# EAGLE design HITOMI (EAGLE 9.6.0)
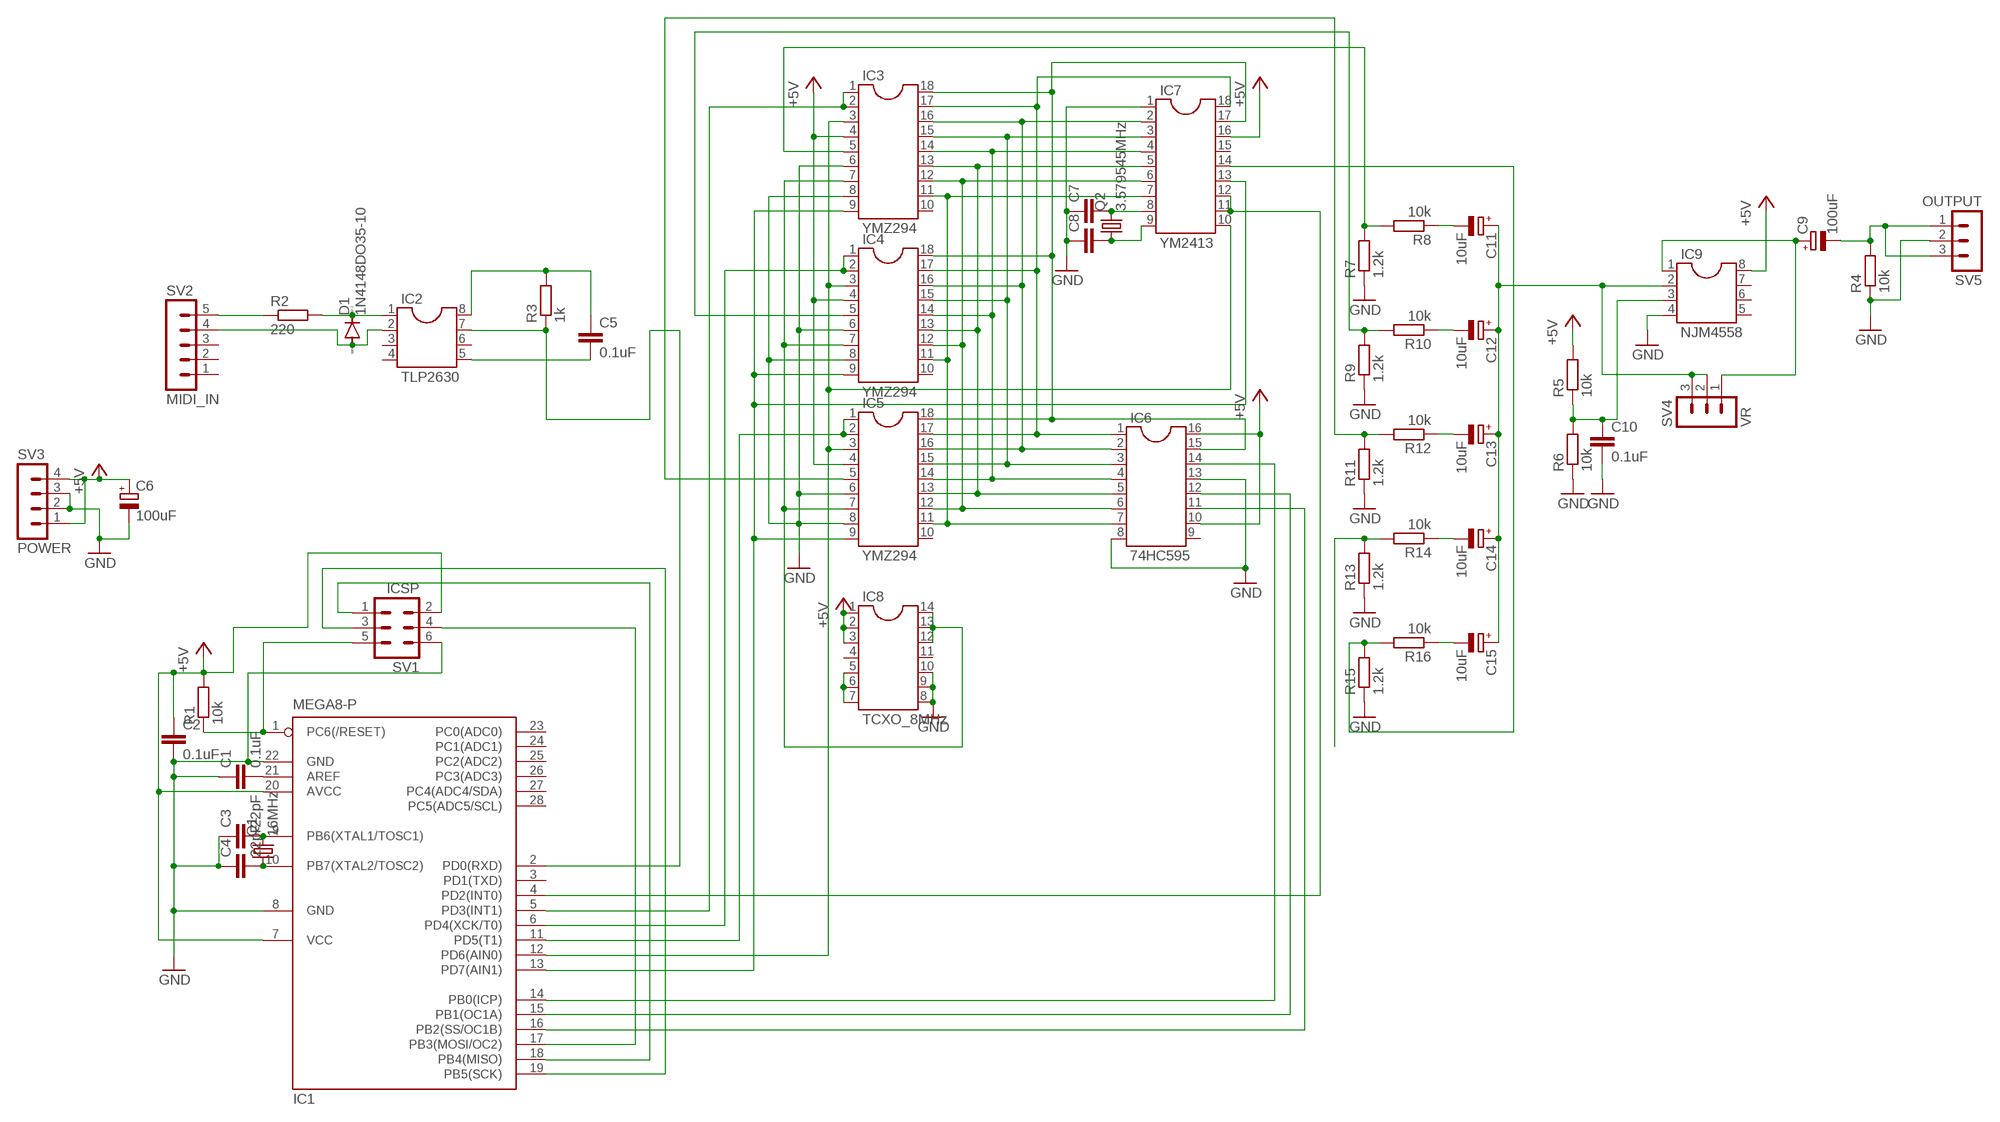
[diagram p0: schematic, sheet 1]

## Parts
C1  0.1uF  C-EU050-025X075  [C050-025X075]
C2  0.1uF  C-EU050-025X075  [C050-025X075]
C3  22pF  C-EU050-025X075  [C050-025X075]
C4  22pF  C-EU050-025X075  [C050-025X075]
C5  0.1uF  C-EU050-025X075  [C050-025X075]
C6  100uF  CPOL-EUE2.5-7  [E2,5-7]
C7  C-EU050-025X075  [C050-025X075]
C8  C-EU050-025X075  [C050-025X075]
C9  100uF  CPOL-EUE2.5-7  [E2,5-7]
C10  0.1uF  C-EU050-025X075  [C050-025X075]
C11  10uF  CPOL-EUE2.5-7  [E2,5-7]
C12  10uF  CPOL-EUE2.5-7  [E2,5-7]
C13  10uF  CPOL-EUE2.5-7  [E2,5-7]
C14  10uF  CPOL-EUE2.5-7  [E2,5-7]
C15  10uF  CPOL-EUE2.5-7  [E2,5-7]
D1  1N4148DO35-10  [DO35-10]
IC1  MEGA8-P  [DIL28-3]
IC2  TLP2630  DIL8  [DIL08]
IC3  YMZ294  DIL18S  [SOCKET-18]
IC4  YMZ294  DIL18S  [SOCKET-18]
IC5  YMZ294  DIL18S  [SOCKET-18]
IC6  74HC595  DIL16S  [SOCKET-16]
IC7  YM2413  DIL18S  [SOCKET-18]
IC8  TCXO_8MHz  DIL14  [DIL14]
IC9  NJM4558  DIL8  [DIL08]
Q1  16MHz  CRYSTALHC49S  [HC49/S]
Q2  3.579545MHz  CRYSTALHC49S  [HC49/S]
R1  10k  R-EU_0207/10  [0207/10]
R2  220  R-EU_0207/10  [0207/10]
R3  1k  R-EU_0207/10  [0207/10]
R4  10k  R-EU_0207/10  [0207/10]
R5  10k  R-EU_0207/10  [0207/10]
R6  10k  R-EU_0207/10  [0207/10]
R7  1.2k  R-EU_0207/10  [0207/10]
R8  10k  R-EU_0207/10  [0207/10]
R9  1.2k  R-EU_0207/10  [0207/10]
R10  10k  R-EU_0207/10  [0207/10]
R11  1.2k  R-EU_0207/10  [0207/10]
R12  10k  R-EU_0207/10  [0207/10]
R13  1.2k  R-EU_0207/10  [0207/10]
R14  10k  R-EU_0207/10  [0207/10]
R15  1.2k  R-EU_0207/10  [0207/10]
R16  10k  R-EU_0207/10  [0207/10]
SV1  ICSP  MA03-2  [MA03-2]
SV2  MIDI_IN  MA05-1  [MA05-1]
SV3  POWER  MA04-1  [MA04-1]
SV4  VR  MA03-1  [MA03-1]
SV5  OUTPUT  MA03-1  [MA03-1]

## Nets
+5V: C2.1 C6.+ IC1.7(VCC) IC1.20(AVCC) IC3.4 IC4.4 IC5.4 IC6.10 IC6.16 IC7.16 IC8.1 IC8.2 IC8.3 IC9.8 R1.2 R5.2 SV1.2 SV3.1 SV3.4
GND: C1.1 C2.2 C3.1 C4.1 C6.- C7.1 C8.1 C10.2 IC1.8(GND) IC1.22(GND) IC3.6 IC3.8 IC4.6 IC4.8 IC5.6 IC5.8 IC6.8 IC6.13 IC7.1 IC8.8 IC8.9 IC8.10 IC9.4 R4.1 R6.1 R7.1 R9.1 R11.1 R13.1 R15.1 SV1.6 SV3.2 SV3.3 SV5.2
N$1: IC1.1(PC6(/RESET)) R1.1 SV1.5
N$2: IC1.17(PB3(MOSI/OC2)) SV1.4
N$3: IC1.18(PB4(MISO)) SV1.1
N$4: C1.2 IC1.21(AREF)
N$5: C3.2 IC1.9(PB6(XTAL1/TOSC1)) Q1.2
N$6: C4.2 IC1.10(PB7(XTAL2/TOSC2)) Q1.1
N$7: IC1.19(PB5(SCK)) SV1.3
N$8: IC3.18 IC4.18 IC5.18 IC6.15 IC7.17
N$9: D1.A IC2.2 SV2.4
N$10: R2.1 SV2.5
N$11: D1.C IC2.1 R2.2
N$12: C5.1 IC2.8 R3.2
N$13: C5.2 IC2.5
N$15: IC1.5(PD3(INT1)) IC3.1 IC3.2
N$16: IC3.11 IC4.11 IC5.11 IC6.7 IC7.7
N$17: IC3.12 IC4.12 IC5.12 IC6.6 IC7.6
N$18: IC3.13 IC4.13 IC5.13 IC6.5 IC7.5
N$19: IC3.14 IC4.14 IC5.14 IC6.4 IC7.4
N$20: IC3.15 IC4.15 IC5.15 IC6.3 IC7.3
N$21: IC3.16 IC4.16 IC5.16 IC6.2 IC7.2
N$22: IC3.17 IC4.17 IC5.17 IC6.1 IC7.18
N$23: IC1.6(PD4(XCK/T0)) IC4.1 IC4.2
N$24: IC1.11(PD5(T1)) IC5.1 IC5.2
N$25: IC1.12(PD6(AIN0)) IC3.3 IC4.3 IC5.3 IC7.10
N$26: C11.+ C12.+ C13.+ C14.+ C15.+ IC9.2 SV4.2 SV4.3
N$27: IC1.4(PD2(INT0)) IC7.11 IC7.12
N$28: IC3.7 IC4.7 IC5.7 IC8.12 IC8.13 IC8.14
N$29: IC8.5 IC8.6 IC8.7
N$30: IC1.13(PD7(AIN1)) IC3.9 IC4.9 IC5.9 IC7.13
N$31: C9.+ IC9.1 SV4.1
N$32: C7.2 IC7.8 Q2.2
N$33: C8.2 IC7.9 Q2.1
N$34: IC1.14(PB0(ICP)) IC6.14
N$35: IC1.15(PB1(OC1A)) IC6.12
N$36: IC1.16(PB2(SS/OC1B)) IC6.11
N$37: C10.1 IC9.3 R5.1 R6.2
N$38: C9.- R4.2 SV5.1 SV5.3
N$39: IC3.5 R7.2 R8.2
N$40: C11.- R8.1
N$41: IC4.5 R9.2 R10.2
N$42: C12.- R10.1
N$43: IC5.5 R11.2 R12.2
N$44: C13.- R12.1
N$45: R13.2 R14.2
N$46: C14.- R14.1
N$47: IC7.14 R15.2 R16.2
N$48: C15.- R16.1
N$49: IC1.2(PD0(RXD)) IC2.7 R3.1
Unconnected: IC1.3(PD1(TXD)) IC1.23(PC0(ADC0)) IC1.24(PC1(ADC1)) IC1.25(PC2(ADC2)) IC1.26(PC3(ADC3)) IC1.27(PC4(ADC4/SDA)) IC1.28(PC5(ADC5/SCL)) IC2.3 IC2.4 IC2.6 IC3.10 IC4.10 IC5.10 IC6.9 IC7.15 IC8.4 IC8.11 IC9.5 IC9.6 IC9.7 SV2.1 SV2.2 SV2.3

## Library data of the parts
C1-C5 C7 C8 C10 = rcl:C-EU: CAPACITOR, European symbol; SPICEPREFIX: C
C6 C9 C11-C15 = rcl:CPOL-EU: POLARIZED CAPACITOR, European symbol; SPICEPREFIX: C
D1 = diode:1N4148: DIODE high speed (Philips)
IC1 = atmel:MEGA8-P: MICROCONTROLLER 8 Kbytes FLASH, 1 kbytes SRAM, 512 bytes EEPROM, USART, 4-channel 10 bit ADC, 2-channel 8 bit ADC Pin compatible with Atmega48, ATMega88, ATMega168 Source: avr.lbr; OC_FARNELL: unknown; OC_NEWARK: unknown
IC2 IC9 = ic-package:DIL8: Dual In Line / Socket
IC3-IC5 IC7 = ic-package:DIL18: Dual In Line / Socket
IC6 = ic-package:DIL16: Dual In Line / Socket
IC8 = ic-package:DIL14: Dual In Line / Socket
Q1 Q2 = crystal:CRYSTAL: CRYSTAL; OC_FARNELL: 1667008; OC_NEWARK: unknown
R1-R16 = rcl:R-EU_: RESISTOR, European symbol; SPICEPREFIX: R
SV1 = con-lstb:MA03-2: PIN HEADER; OC_FARNELL: unknown; OC_NEWARK: unknown
SV2 = con-lstb:MA05-1: PIN HEADER; OC_FARNELL: unknown; OC_NEWARK: unknown
SV3 = con-lstb:MA04-1: PIN HEADER; OC_FARNELL: unknown; OC_NEWARK: unknown
SV4 SV5 = con-lstb:MA03-1: PIN HEADER; OC_FARNELL: unknown; OC_NEWARK: unknown

## Net classes
0 default: width 0.889 mm

## Board
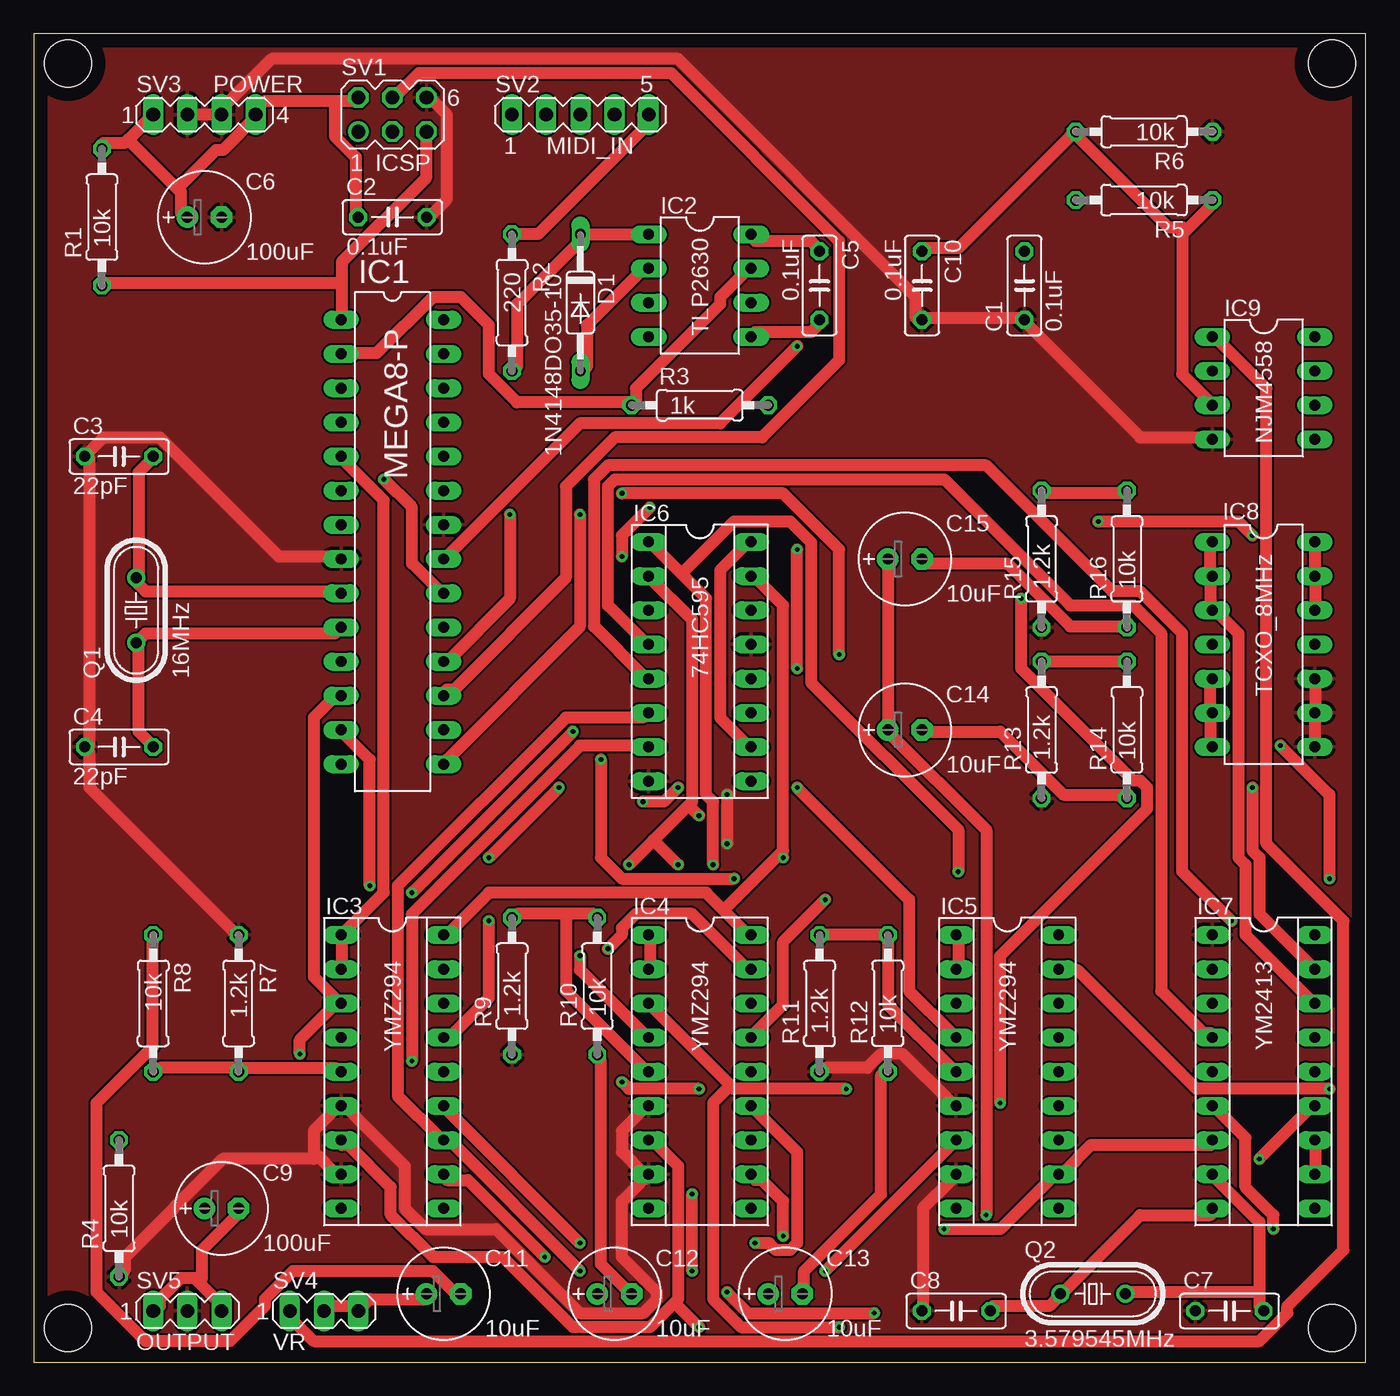
[diagram p1: board, top side]
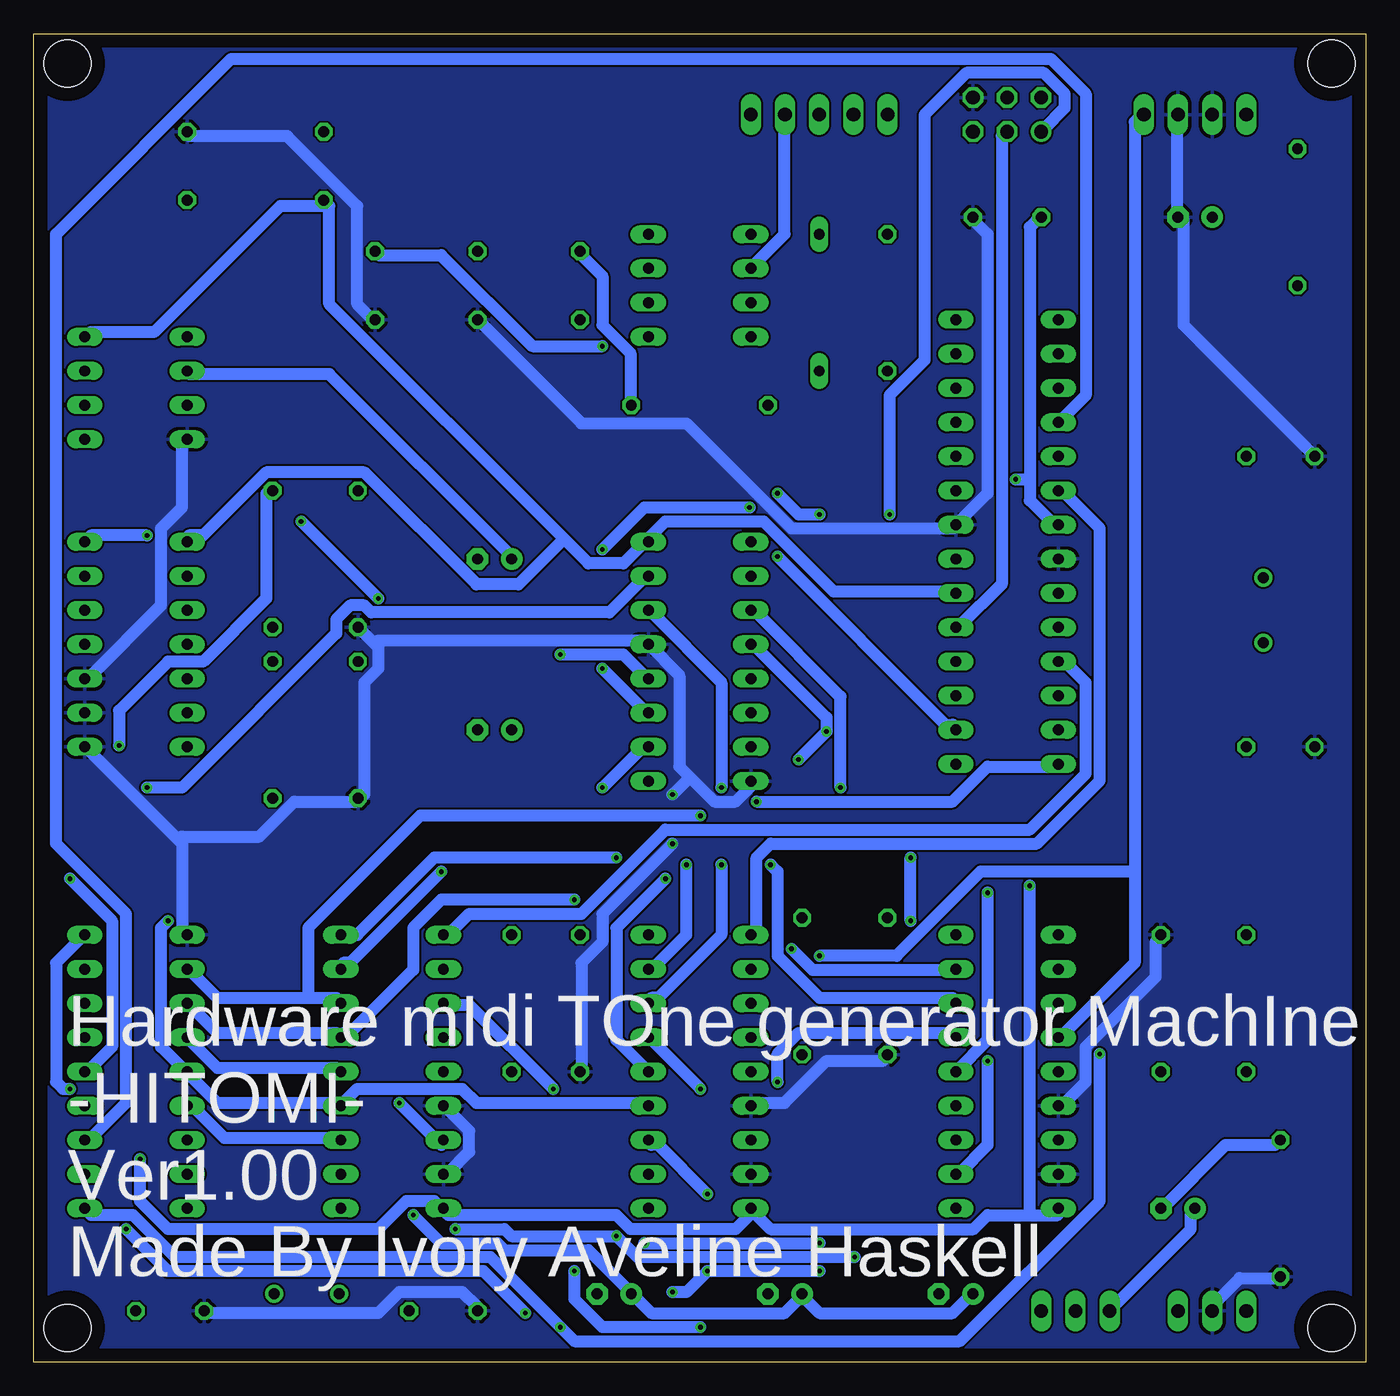
[diagram p2: board, bottom side, seen from below]

Size 99.04 x 98.73 mm. Coordinates in mm from the lower left corner, seen from the top.
Outline: 0,0 99.04,0 99.04,98.73 0,98.73 0,0
Copper layers (1*16): Top 0.035mm / dielectric 1.5mm / Bottom 0.035mm
Design rules "default": minimum track width 6mil, minimum drill 0.35mm, track to track 6mil, track to pad 6mil, pad to pad 6mil, via to via 6mil, smd to smd 6mil, copper to edge 40mil, drill to drill 6mil, minimum pad ring 10mil, minimum via ring 8mil, stop-mask expansion 4mil, vias tented up to drill 0mil, thermal gap 10mil
Holes 3.5 mm at 2.54,96.52 2.54,2.54 96.52,2.54 96.52,96.52

### Footprints (pad centres in the part's own frame; a part is rotated, then mirrored left to right if it is on the bottom)
C050-025X075 = drill 0.813 octagon: 1 -2.54,0; 2 2.54,0
E2,5-7 = drill 0.813 pad 1.6: + -1.27,0 | drill 0.813 pad 1.6 octagon: - 1.27,0
DO35-10 = drill 0.813 long: A 5.08,0; C -5.08,0
DIL28-3 = drill 0.813 long: 1 -16.51,-3.81; 2 -13.97,-3.81; 3 -11.43,-3.81; 4 -8.89,-3.81; 5 -6.35,-3.81; 6 -3.81,-3.81; 7 -1.27,-3.81; 8 1.27,-3.81; 9 3.81,-3.81; 10 6.35,-3.81; 11 8.89,-3.81; 12 11.43,-3.81; 13 13.97,-3.81; 14 16.51,-3.81; 15 16.51,3.81; 16 13.97,3.81; 17 11.43,3.81; 18 8.89,3.81; 19 6.35,3.81; 20 3.81,3.81; 21 1.27,3.81; 22 -1.27,3.81; 23 -3.81,3.81; 24 -6.35,3.81; 25 -8.89,3.81; 26 -11.43,3.81; 27 -13.97,3.81; 28 -16.51,3.81
DIL08 = drill 0.813 long: 1 -3.81,-3.81; 2 -1.27,-3.81; 3 1.27,-3.81; 4 3.81,-3.81; 5 3.81,3.81; 6 1.27,3.81; 7 -1.27,3.81; 8 -3.81,3.81
SOCKET-18 = drill 0.813 long: 1 -10.16,-3.81; 2 -7.62,-3.81; 3 -5.08,-3.81; 4 -2.54,-3.81; 5 0,-3.81; 6 2.54,-3.81; 7 5.08,-3.81; 8 7.62,-3.81; 9 10.16,-3.81; 10 10.16,3.81; 11 7.62,3.81; 12 5.08,3.81; 13 2.54,3.81; 14 0,3.81; 15 -2.54,3.81; 16 -5.08,3.81; 17 -7.62,3.81; 18 -10.16,3.81
SOCKET-16 = drill 0.813 long: 1 -8.89,-3.81; 2 -6.35,-3.81; 3 -3.81,-3.81; 4 -1.27,-3.81; 5 1.27,-3.81; 6 3.81,-3.81; 7 6.35,-3.81; 8 8.89,-3.81; 9 8.89,3.81; 10 6.35,3.81; 11 3.81,3.81; 12 1.27,3.81; 13 -1.27,3.81; 14 -3.81,3.81; 15 -6.35,3.81; 16 -8.89,3.81
DIL14 = drill 0.813 long: 1 -7.62,-3.81; 2 -5.08,-3.81; 3 -2.54,-3.81; 4 0,-3.81; 5 2.54,-3.81; 6 5.08,-3.81; 7 7.62,-3.81; 8 7.62,3.81; 9 5.08,3.81; 10 2.54,3.81; 11 0,3.81; 12 -2.54,3.81; 13 -5.08,3.81; 14 -7.62,3.81
HC49/S = drill 0.813: 1 -2.413,0; 2 2.413,0
0207/10 = drill 0.813 octagon: 1 -5.08,0; 2 5.08,0
MA03-2 = drill 1.016: 1 -2.54,-1.27 | drill 1.016 octagon: 2 -2.54,1.27; 3 0,-1.27; 4 0,1.27; 5 2.54,-1.27; 6 2.54,1.27
MA05-1 = drill 1.016 long: 1 -5.08,0; 2 -2.54,0; 3 0,0; 4 2.54,0; 5 5.08,0
MA04-1 = drill 1.016 long: 1 -3.81,0; 2 -1.27,0; 3 1.27,0; 4 3.81,0
MA03-1 = drill 1.016 long: 1 -2.54,0; 2 0,0; 3 2.54,0

### Placement (x,y rotation side)
C1  73.66,80.01 90 top
C2  26.67,85.09 0 top
C3  6.35,67.31 0 top
C4  6.35,45.72 0 top
C5  58.42,80.01 270 top
C6  12.7,85.09 0 top
C7  88.9,3.81 0 top
C8  68.58,3.81 0 top
C9  13.97,11.43 0 top
C10  66.04,80.01 270 top
C11  30.48,5.08 0 top
C12  43.18,5.08 0 top
C13  55.88,5.08 0 top
C14  64.77,46.99 0 top
C15  64.77,59.69 0 top
D1  40.64,78.74 270 top
IC1  26.67,60.96 270 top
IC2  49.53,80.01 270 top
IC3  26.67,21.59 270 top
IC4  49.53,21.59 270 top
IC5  72.39,21.59 270 top
IC6  49.53,52.07 270 top
IC7  91.44,21.59 270 top
IC8  91.44,53.34 270 top
IC9  91.44,72.39 270 top
Q1  7.62,55.88 90 top
Q2  78.74,5.08 0 top
R1  5.08,85.09 90 top
R2  35.56,78.74 270 top
R3  49.53,71.12 0 top
R4  6.35,11.43 90 top
R5  82.55,86.36 180 top
R6  82.55,91.44 180 top
R7  15.24,26.67 270 top
R8  8.89,26.67 270 top
R9  35.56,27.94 90 top
R10  41.91,27.94 90 top
R11  58.42,26.67 90 top
R12  63.5,26.67 90 top
R13  74.93,46.99 90 top
R14  81.28,46.99 90 top
R15  74.93,59.69 90 top
R16  81.28,59.69 90 top
SV1  26.67,92.71 0 top
SV2  40.64,92.71 0 top
SV3  12.7,92.71 0 top
SV4  21.59,3.81 0 top
SV5  11.43,3.81 0 top

### Tracks (layer width: path | path; a pad name or v marks a point on that pad's centre or on a via)
+5V  (via drill 0.35)
  Top 0.889: 7.03,90.86 8.85,92.69 SV3.1 | 7.03,90.86 6.77,90.6 5.21,90.6 R1.2 | 7.03,90.86 10.67,87.22 | 10.67,87.22 10.94,86.96 10.94,85.39 C6.+ | v40.62,30.2 40.62,29.16 45.3,24.47 IC4.4 | 22.39,93.73 17.18,93.73 16.66,93.2 SV3.4 16.66,92.69 14.06,90.08 13.54,90.08 10.67,87.22 | 22.39,93.73 23.95,93.73 SV1.2 | 22.39,93.73 22.39,91.12 23.95,89.56 23.95,85.39 C2.1 | IC7.16 94.77,27.08 90.08,31.76 90.08,36.97 89.56,37.49 89.56,54.15 88,55.72 IC8.3 87.48,56.24 87.48,58.32 IC8.2 87.48,58.84 87.48,60.92 IC8.1 | IC6.10 53.11,45.82 51.03,47.9 51.03,58.84 53.11,60.92 IC6.16 | v56.76,42.7 65.09,34.37 65.09,27.6 68.21,24.47 IC5.4 | v26.04,65.61 28.12,63.52 28.12,59.36 30.2,57.28 IC1.20
  Bottom 0.889: 24.99,65.61 24.99,84.35 24.47,84.87 C2.1 | 24.99,65.61 24.99,64.05 23.43,62.48 22.91,62.48 IC1.7 | 17.18,36.45 17.18,92.16 16.66,92.69 SV3.4 | 17.18,36.45 17.18,29.68 22.39,24.47 IC3.4 | v40.62,30.2 34.89,30.2 28.64,36.45 17.18,36.45 | IC9.8 94.77,76.54 90.08,76.54 80.71,85.92 77.58,85.92 R5.2 77.06,85.92 77.06,78.63 59.62,61.18 | v56.76,42.7 53.63,45.82 IC6.10 | IC1.20 30.72,57.28 39.57,57.28 44.78,62.48 52.07,62.48 53.11,61.44 IC6.16 53.63,60.92 55.19,59.36 57.8,59.36 59.62,61.18 | 59.62,61.18 63.01,57.8 66.13,57.8 74.46,66.13 81.75,66.13 86.44,61.44 87.48,61.44 IC8.1 | v26.04,65.61 24.99,65.61
GND  (via drill 0.35)
  Top 0.889: SV3.2 11.46,92.69 13.54,92.69 SV3.3 14.06,93.2 17.7,96.85 47.9,96.85 65.61,79.15 65.61,77.58 C10.2 66.13,77.58 73.42,77.58 C1.1 73.94,77.06 82.27,68.73 87.48,68.73 IC9.4 | IC1.8 22.39,59.88 18.22,59.88 9.37,68.73 5.21,68.73 4.17,67.69 C3.1 4.17,67.17 4.17,45.82 C4.1 4.17,45.3 4.17,42.7 15.1,31.76 R7.1 | IC4.6 45.3,18.75 43.74,17.18 43.74,15.62 45.3,14.06 IC4.8 45.3,13.54 43.74,11.98 43.74,7.81 46.34,5.21 46.34,4.69 45.3,3.65 40.62,3.65 34.37,9.89 29.16,9.89 27.6,11.46 27.6,14.58 22.91,19.27 IC3.6 22.39,18.75 20.83,17.18 20.83,15.62 21.09,15.36 | 21.09,15.36 22.39,14.06 IC3.8 | R4.1 6.77,6.77 6.77,7.81 14.06,15.1 20.83,15.1 21.09,15.36 | SV1.6 29.68,93.73 30.72,92.69 30.72,86.44 29.68,85.39 C2.2 | C8.1 66.13,4.17 66.13,11.46 68.21,13.54 IC5.8 | R11.1 58.84,21.87 61.96,21.87 63.01,22.91 64.57,22.91 68.21,19.27 IC5.6 | IC8.10 95.29,50.51 95.29,48.42 IC8.9 95.29,47.9 95.29,45.82 IC8.8 | v51.55,42.18 v51.55,38.53
  Bottom 0.889: SV3.3 14.06,92.69 14.06,85.39 C6.- 13.54,84.87 13.54,77.06 4.17,67.69 C3.1 | R9.1 35.93,22.39 40.09,22.39 43.22,19.27 45.3,19.27 IC4.6 | R4.1 6.77,6.25 9.37,6.25 11.46,4.17 SV5.2 | R7.1 15.62,31.24 15.62,28.64 20.83,23.43 20.83,20.83 22.39,19.27 IC3.6 | C2.2 29.16,84.87 28.12,83.83 28.12,64.57 30.2,62.48 IC1.22 30.72,61.96 42.7,61.96 50.51,69.77 58.32,69.77 65.61,77.06 C10.2 | R6.1 87.48,91.12 80.19,91.12 74.98,85.92 74.98,78.63 73.94,77.58 C1.1 | IC5.6 68.21,18.75 66.65,17.18 66.65,15.62 68.21,14.06 IC5.8 | C7.1 85.92,3.65 73.42,3.65 71.86,5.21 67.17,5.21 66.13,4.17 C8.1 | 50.25,43.48 51.03,44.26 51.03,51.03 IC6.13 53.63,53.63 73.42,53.63 73.68,53.37 | 50.25,43.48 48.42,41.66 46.86,41.66 45.82,42.7 IC6.8 | 73.68,53.37 74.46,54.15 R15.1 | 73.68,53.37 73.42,53.11 73.42,51.55 74.46,50.51 74.46,42.18 R13.1 74.98,41.66 79.67,41.66 82.27,39.05 88,39.05 88.26,38.79 | 88.26,38.79 94.77,45.3 IC8.8 | 88.26,38.79 88,38.53 88,31.76 IC7.1 | v51.55,38.53 56.76,33.33 56.76,31.24 58.32,29.68 58.32,21.87 R11.1 | 50.25,43.48 v51.55,42.18 | IC9.4 88,68.21 88,63.52 89.56,61.96 89.56,56.24 94.77,51.03 IC8.10
  pour Bottom: 0,99.06 0,0 99.06,0 99.06,99.06
  pour Top: 0,99.06 0,0 99.06,0 99.06,99.06
N$1
  Top 0.889: 22.91,80.19 22.91,81.75 29.16,88 29.16,91.12 SV1.5 | 22.91,80.19 22.91,77.58 IC1.1 | 22.91,80.19 5.21,80.19 R1.1
N$2
  Top 0.889: IC1.17 30.72,49.99 31.24,49.99 39.57,58.32 39.57,65.09 43.22,68.73 54.15,68.73 59.88,74.46 59.88,83.31 47.38,95.81 28.64,95.81 27.08,94.25 SV1.4
N$3  (via drill 0.35)
  Top 0.889: v35.41,63.01 35.41,56.76 30.72,52.07 IC1.18
  Bottom 0.889: v35.41,63.01 35.41,71.86 32.8,74.46 32.8,92.69 29.68,95.81 23.95,95.81 22.39,94.25 22.39,93.2 23.95,91.64 SV1.1
N$4  (via drill 0.35)
  Top 0.889: v56.76,75.5 51.03,69.77 40.62,69.77 30.72,59.88 IC1.21
  Bottom 0.889: v56.76,75.5 61.96,75.5 68.73,82.27 73.42,82.27 C1.2
N$5
  Top 0.889: C3.2 8.85,67.17 7.81,66.13 7.81,58.32 Q1.2 7.81,57.8 8.33,57.28 22.39,57.28 IC1.9
N$6
  Top 0.889: C4.2 8.85,45.82 7.81,46.86 7.81,53.11 Q1.1 7.81,53.63 8.33,54.15 22.39,54.15 IC1.10
N$7
  Bottom 0.889: IC1.19 30.2,54.67 27.08,57.8 27.08,91.12 SV1.3
N$8  (via drill 0.35)
  Top 0.889: 51.29,33.59 53.11,31.76 IC4.18 | 51.29,33.59 49.99,34.89 33.85,34.89 30.72,31.76 IC3.18 | 51.29,33.59 55.45,37.75 | 55.45,37.75 55.72,38.01 55.72,56.24 53.63,58.32 IC6.15 | v55.72,37.49 55.45,37.75 | v90.6,42.7 90.6,38.01 91.12,37.49 91.12,33.33 94.77,29.68 IC7.17
  Bottom 0.889: v55.72,37.49 69.25,37.49 74.98,31.76 76.02,31.76 IC5.18 | v90.6,42.7 88,42.7 76.54,54.15 76.54,55.19 75.5,56.24 74.46,56.24 73.94,55.72 56.24,55.72 53.63,58.32 IC6.15
N$9
  Top 0.889: D1.A 41.13,73.94 41.13,77.06 45.3,81.23 IC2.2
  Bottom 0.889: SV2.4 43.22,92.69 43.22,83.83 45.3,81.75 IC2.2
N$10
  Top 0.889: R2.1 35.93,83.83 37.49,83.83 45.3,91.64 45.3,92.69 SV2.5
N$11
  Top 0.889: R2.2 35.93,73.94 35.93,78.63 40.62,83.31 D1.C 41.13,83.83 45.3,83.83 IC2.1
N$12
  Top 0.889: IC2.8 53.63,83.31 57.8,83.31 58.32,82.79 C5.1
  Bottom 0.889: R3.2 54.67,71.34 54.67,74.98 56.76,77.06 56.76,80.71 58.32,82.27 C5.1
N$13
  Top 0.889: IC2.5 53.63,76.54 57.8,76.54 58.32,77.06 C5.2
N$15
  Top 0.889: IC3.2 22.91,29.68 22.91,31.24 IC3.1 22.91,31.76 26.04,34.89 26.04,64.05 22.91,67.17 IC1.5
N$16  (via drill 0.35)
  Top 0.889: v55.72,9.37 55.72,11.98 54.15,13.54 53.63,13.54 IC4.11 | v67.69,9.89 71.86,9.89 76.02,14.06 IC5.11 76.54,14.06 78.63,16.14 87.48,16.14 IC7.7 | v28.12,22.39 28.12,33.33 40.62,45.82 45.3,45.82 IC6.7 | v38.01,7.81 32.28,13.54 30.72,13.54 IC3.11
  Bottom 0.889: v67.69,9.89 64.05,9.89 63.52,9.37 v55.72,9.37 54.15,7.81 v38.01,7.81 | v28.12,22.39 28.12,16.14 30.2,14.06 IC3.11
N$17  (via drill 0.35)
  Top 0.889: IC6.6 45.3,47.9 39.57,47.9 27.08,35.41 27.08,19.79 30.2,16.66 IC3.12 30.72,16.66 v40.62,6.77 | v48.95,6.77 v48.95,12.5 | v92.16,9.89 92.16,10.94 90.08,13.02 90.08,16.66 88,18.75 IC7.6 | v62.48,3.65 53.11,3.65 v51.55,5.21
  Bottom 0.889: IC5.12 76.54,16.66 84.87,16.66 87.48,19.27 IC7.6 | v48.95,12.5 52.59,16.14 53.11,16.14 IC4.12 | v40.62,6.77 v48.95,6.77 50.51,5.21 v51.55,5.21 | v92.16,9.89 89.04,6.77 65.61,6.77 v62.48,3.65
N$18  (via drill 0.35)
  Top 0.889: v40.62,8.85 30.72,18.75 IC3.13 | v53.63,8.85 54.67,8.85 55.19,8.33 56.24,8.33 56.76,8.85 56.76,15.62 53.63,18.75 IC4.13 | v89.04,32.8 85.39,36.45 85.39,54.15 82.27,57.28 80.19,57.28 70.81,66.65 42.7,66.65 41.66,65.61 41.66,54.67 45.3,51.03 IC6.5
  Bottom 0.889: v53.63,8.85 v40.62,8.85 | v89.04,32.8 89.56,32.28 89.56,23.43 88,21.87 IC7.5 87.48,21.35 85.39,19.27 76.54,19.27 IC5.13 76.02,19.27 74.98,20.31 67.17,20.31 66.13,19.27 53.63,19.27 IC4.13
N$19  (via drill 0.35)
  Top 0.889: v40.09,46.86 v28.12,34.89 | v52.07,35.93 43.74,35.93 42.18,37.49 v42.18,44.78 | IC7.4 87.48,24.47 86.96,24.47 83.83,27.6 83.83,54.15 81.75,56.24 77.06,56.24 67.69,65.61 43.22,65.61 42.7,65.09 42.7,56.24 45.3,53.63 IC6.4
  Bottom 0.889: IC5.14 76.54,21.87 85.39,21.87 87.48,23.95 IC7.4 | IC3.14 28.12,23.95 v28.12,34.89 | IC6.4 45.3,53.11 40.09,47.9 v40.09,46.86 v42.18,44.78 | v52.07,35.93 55.72,32.28 55.72,23.95 53.63,21.87 IC4.14
N$20  (via drill 0.35)
  Top 0.889: v43.74,20.83 44.26,20.31 v49.47,20.31 | v33.85,37.49 v39.05,42.7 | v33.85,32.8 33.85,27.08 30.72,23.95 IC3.15 | v58.84,34.37 55.72,31.24 55.72,26.56 53.63,24.47 IC4.15
  Bottom 0.889: IC7.3 87.48,26.56 85.39,24.47 76.54,24.47 IC5.15 76.02,24.47 75.5,24.47 70.81,29.16 70.81,32.28 68.73,34.37 v58.84,34.37 | v43.74,20.83 43.74,22.91 42.18,24.47 30.72,24.47 IC3.15 | v49.47,20.31 53.11,23.95 IC4.15 | v39.05,42.7 39.05,49.47 45.3,55.72 IC6.3 | v33.85,32.8 v33.85,37.49
N$21  (via drill 0.35)
  Top 0.889: 48.69,41.4 48.95,41.66 48.95,55.19 IC6.2 | 48.69,41.4 46.08,38.79 | 46.08,38.79 v44.26,36.97 | 46.08,38.79 v47.9,36.97 | 48.69,41.4 v49.47,40.62
  Bottom 0.889: 78.63,27.08 85.39,27.08 87.48,29.16 IC7.2 | 78.63,27.08 76.54,27.08 IC5.16 | v44.26,36.97 43.74,36.45 43.74,30.2 40.62,27.08 30.72,27.08 IC3.16 | v47.9,36.97 47.9,31.76 52.59,27.08 53.11,27.08 IC4.16 | 78.63,27.08 78.63,32.28 70.29,40.62 v49.47,40.62
N$22  (via drill 0.35)
  Top 0.889: v96.33,20.31 86.44,20.31 77.58,29.16 76.54,29.16 IC5.17 | v42.7,30.72 43.74,31.76 43.74,32.28 44.78,33.33 48.95,33.33 53.11,29.16 IC4.17 | 48.16,58.58 49.99,56.76 49.99,42.18 50.51,41.66 v50.51,36.97 | 48.16,58.58 45.82,60.92 IC6.1 | v68.73,36.45 68.73,39.57 57.8,50.51 57.8,60.92 56.24,62.48 52.07,62.48 48.16,58.58
  Bottom 0.889: v96.33,20.31 96.85,20.31 97.37,20.83 97.37,29.68 95.29,31.76 IC7.18 | v42.7,30.72 41.13,29.16 30.72,29.16 IC3.17 | v50.51,36.97 50.51,31.76 53.11,29.16 IC4.17 | v68.73,36.45 75.5,29.68 76.02,29.68 IC5.17
N$23
  Top 0.889: IC4.2 45.82,29.68 45.82,31.24 IC4.1
  Bottom 0.889: IC1.6 22.39,64.57 19.79,61.96 19.79,43.22 24.47,38.53 44.26,38.53 45.3,37.49 45.3,31.76 IC4.1
N$24
  Top 0.889: IC5.2 68.73,29.68 68.73,31.24 IC5.1
  Bottom 0.889: IC1.11 22.39,52.07 20.83,50.51 20.83,43.74 24.99,39.57 52.07,39.57 58.32,33.33 66.65,33.33 68.21,31.76 IC5.1
N$25  (via drill 0.35)
  Top 0.889: IC1.12 22.39,49.47 20.83,47.9 20.83,28.64 22.39,27.08 IC3.3 22.39,26.56 19.79,23.95 v19.79,22.91 | 51.81,20.57 52.07,20.31 v60.4,20.31 | 51.81,20.57 45.82,26.56 IC4.3 | v59.88,2.6 52.59,2.6 50.51,4.69 50.51,19.27 51.81,20.57
  Bottom 0.889: v60.4,20.31 66.65,26.56 68.21,26.56 IC5.3 | IC7.10 94.77,10.94 91.64,10.94 88.52,7.81 65.09,7.81 v59.88,2.6 58.84,1.56 30.2,1.56 19.79,11.98 v19.79,22.91
N$26  (via drill 0.35)
  Top 0.889: SV4.2 21.87,4.17 23.95,4.17 SV4.3 24.47,4.17 24.99,4.69 29.16,4.69 C11.+ | C15.+ 63.52,59.36 63.52,47.38 C14.+ 63.52,46.86 70.81,39.57 v70.81,10.94
  Bottom 0.889: C11.+ 29.68,4.69 30.72,3.65 40.62,3.65 41.66,4.69 C12.+ 42.18,4.69 43.22,3.65 53.11,3.65 54.15,4.69 C13.+ 54.67,5.21 57.8,8.33 64.05,8.33 64.57,8.85 68.73,8.85 v70.81,10.94 | IC9.2 87.48,73.42 77.06,73.42 63.52,59.88 C15.+
N$27
  Top 0.889: IC7.11 95.29,14.06 95.29,16.14 IC7.12
  Bottom 0.889: IC1.4 22.39,70.29 20.83,71.86 20.83,94.25 23.43,96.85 84.35,96.85 97.37,83.83 97.37,38.53 92.16,33.33 92.16,19.27 94.77,16.66 IC7.12
N$28  (via drill 0.35)
  Top 0.889: IC8.12 95.29,56.24 95.29,58.32 IC8.13 95.29,58.84 95.29,60.92 IC8.14 | 47.64,4.43 47.9,4.69 47.9,14.58 45.82,16.66 IC4.7 | 47.64,4.43 45.82,2.6 40.09,2.6 34.89,7.81 29.68,7.81 26.56,10.94 26.56,13.02 23.43,16.14 22.91,16.14 IC3.7 | v58.84,6.77 IC5.7 | 47.64,4.43 v49.47,2.6 | v90.6,61.44 89.56,62.48 v79.15,62.48 | v73.42,56.76 73.42,51.55 81.75,43.22 82.27,43.22 82.79,42.7 82.79,41.13 71.86,30.2 v71.86,19.27
  Bottom 0.889: v58.84,6.77 58.84,4.69 56.76,2.6 v49.47,2.6 | v90.6,61.44 94.77,61.44 IC8.14 | v73.42,56.76 v79.15,62.48 | v71.86,19.27 68.73,16.14 IC5.7
N$29
  Top 0.889: IC8.7 87.48,45.82 87.48,47.9 IC8.6 87.48,48.42 87.48,50.51 IC8.5
N$30  (via drill 0.35)
  Top 0.889: v91.12,15.1 94.77,18.75 IC7.13 | v24.99,35.41 24.99,44.78 22.91,46.86 IC1.13
  Bottom 0.889: 24.99,10.94 28.12,10.94 29.16,9.89 44.26,9.89 45.3,10.94 IC4.9 45.82,10.94 46.86,9.89 54.67,9.89 55.72,10.94 68.21,10.94 IC5.9 68.73,11.46 69.25,11.98 71.34,11.98 73.42,9.89 89.04,9.89 91.12,11.98 v91.12,15.1 | 24.99,10.94 22.91,10.94 IC3.9 | 24.99,10.94 v24.99,35.41
N$31
  Top 0.889: IC9.1 88,76.02 91.64,72.38 91.64,38.53 97.37,32.8 97.37,8.33 93.2,4.17 93.2,3.65 91.12,1.56 20.83,1.56 18.75,3.65 SV4.1
  Bottom 0.889: C9.+ 13.02,10.94 13.02,9.89 18.75,4.17 SV4.1
N$32
  Top 0.889: 91.12,5.21 91.12,10.41 88,13.54 IC7.8 | 91.12,5.21 91.12,4.17 C7.2 | 91.12,5.21 81.23,5.21 Q2.2
N$33
  Top 0.889: C8.2 71.34,4.17 75.5,4.17 76.02,4.69 Q2.1 76.54,5.21 82.27,10.94 87.48,10.94 IC7.9
N$34  (via drill 0.35)
  Top 0.889: v45.3,41.66 46.86,41.66 v47.9,42.7
  Bottom 0.889: v45.3,41.66 30.72,41.66 28.12,44.26 22.91,44.26 IC1.14 | v47.9,42.7 47.9,50.51 53.11,55.72 IC6.14
N$35  (via drill 0.35)
  Top 0.889: v40.62,63.01 40.62,54.67 30.72,44.78 IC1.15 | v43.74,64.57 55.72,64.57 59.88,60.4 v59.88,52.59
  Bottom 0.889: v40.62,63.01 42.18,63.01 v43.74,64.57 | v59.88,52.59 55.19,52.59 53.63,51.03 IC6.12
N$36  (via drill 0.35)
  Top 0.889: v43.74,59.88 43.74,61.44 v45.82,63.52 | v56.76,51.55 v56.76,60.4
  Bottom 0.889: v43.74,59.88 31.24,47.38 30.72,47.38 IC1.16 | v45.82,63.52 53.63,63.52 v56.76,60.4 | v56.76,51.55 53.63,48.42 IC6.11
N$37
  Top 0.889: 85.66,84.09 87.48,85.92 R5.1 | 85.66,84.09 85.39,83.83 85.39,73.42 87.48,71.34 IC9.3 | C10.1 66.13,82.79 68.73,82.79 77.06,91.12 R6.2 77.58,91.12 84.35,84.35 85.39,84.35 85.66,84.09
N$38
  Top 0.889: 12.24,5.99 14.06,4.17 SV5.3 | 12.24,5.99 11.98,6.25 10.94,6.25 9.37,4.69 9.37,4.17 SV5.1 | 12.24,5.99 12.5,6.25 12.5,8.33 15.1,10.94 C9.-
  Bottom 0.889: R4.2 6.77,16.14 10.41,16.14 15.1,11.46 C9.-
N$39
  Top 0.889: R8.2 9.37,21.87 15.1,21.87 R7.2 15.62,21.87 22.39,21.87 IC3.5
N$40
  Top 0.889: R8.1 8.85,31.24 8.85,23.43 4.69,19.27 4.69,5.21 8.33,1.56 14.58,1.56 17.18,4.17 17.18,4.69 19.27,6.77 29.68,6.77 31.24,5.21 C11.-
N$41
  Top 0.889: 39.57,33.33 41.66,33.33 R10.2 | 39.57,33.33 35.93,33.33 R9.2 | 39.57,33.33 39.57,27.6 45.3,21.87 IC4.5
N$42
  Top 0.889: R10.1 42.18,22.39 42.18,7.29 44.26,5.21 C12.-
N$43
  Top 0.889: R11.2 58.84,31.76 63.01,31.76 R12.2 63.52,31.24 63.52,26.56 68.21,21.87 IC5.5
N$44
  Top 0.889: R12.1 63.01,21.35 63.01,12.5 57.28,6.77 57.28,5.21 C13.-
N$45
  Top 0.889: R14.2 R13.2
N$46
  Top 0.889: R14.1 81.23,42.18 76.54,42.18 71.86,46.86 66.13,46.86 C14.-
N$47  (via drill 0.35)
  Top 0.889: v96.33,35.93 96.33,42.18 v92.69,45.82 | R15.2 74.98,64.57 81.23,64.57 R16.2
  Bottom 0.889: v96.33,35.93 93.2,32.8 93.2,23.43 94.77,21.87 IC7.14 | v92.69,45.82 92.69,48.42 89.04,52.07 86.44,52.07 81.75,56.76 81.75,64.57 R16.2
N$48
  Top 0.889: R16.1 81.23,54.67 77.06,54.67 72.38,59.36 66.13,59.36 C15.-
N$49
  Top 0.889: IC2.7 53.11,81.23 51.03,79.15 51.03,78.63 44.78,72.38 44.78,71.34 R3.1 44.26,71.34 35.93,71.34 33.85,73.42 33.85,77.06 31.76,79.15 29.68,79.15 25.51,74.98 22.91,74.98 IC1.2

### Text on the board
bPlace: Hardware mIdi TOne generator MachIne / -HITOMI- / Ver1.00 / Made By Ivory Aveline Haskell